# Altium schematic sheet PCB Bus.SchDoc
size A1
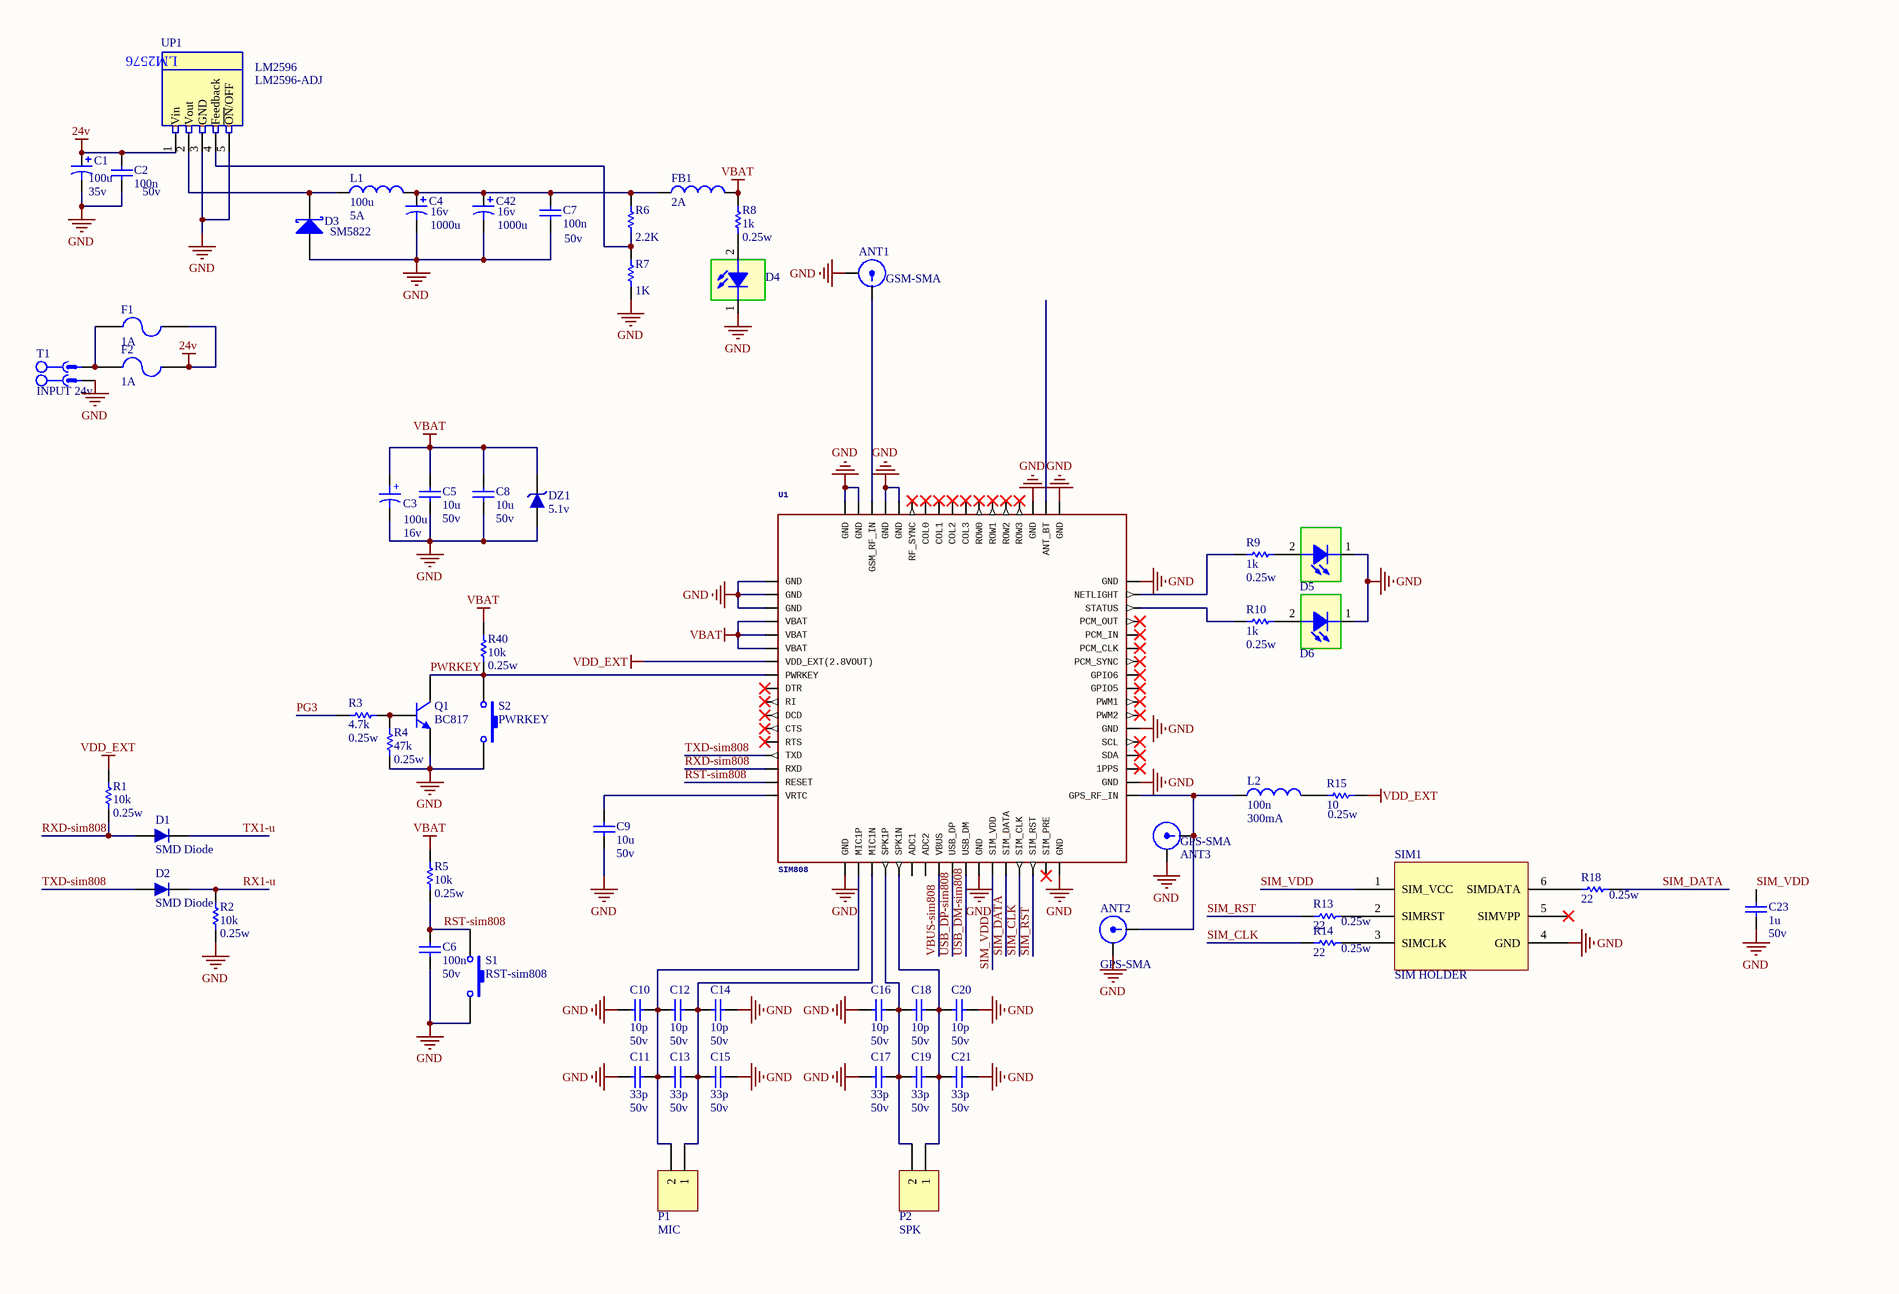
[diagram p0: PCB Bus.SchDoc, top left]
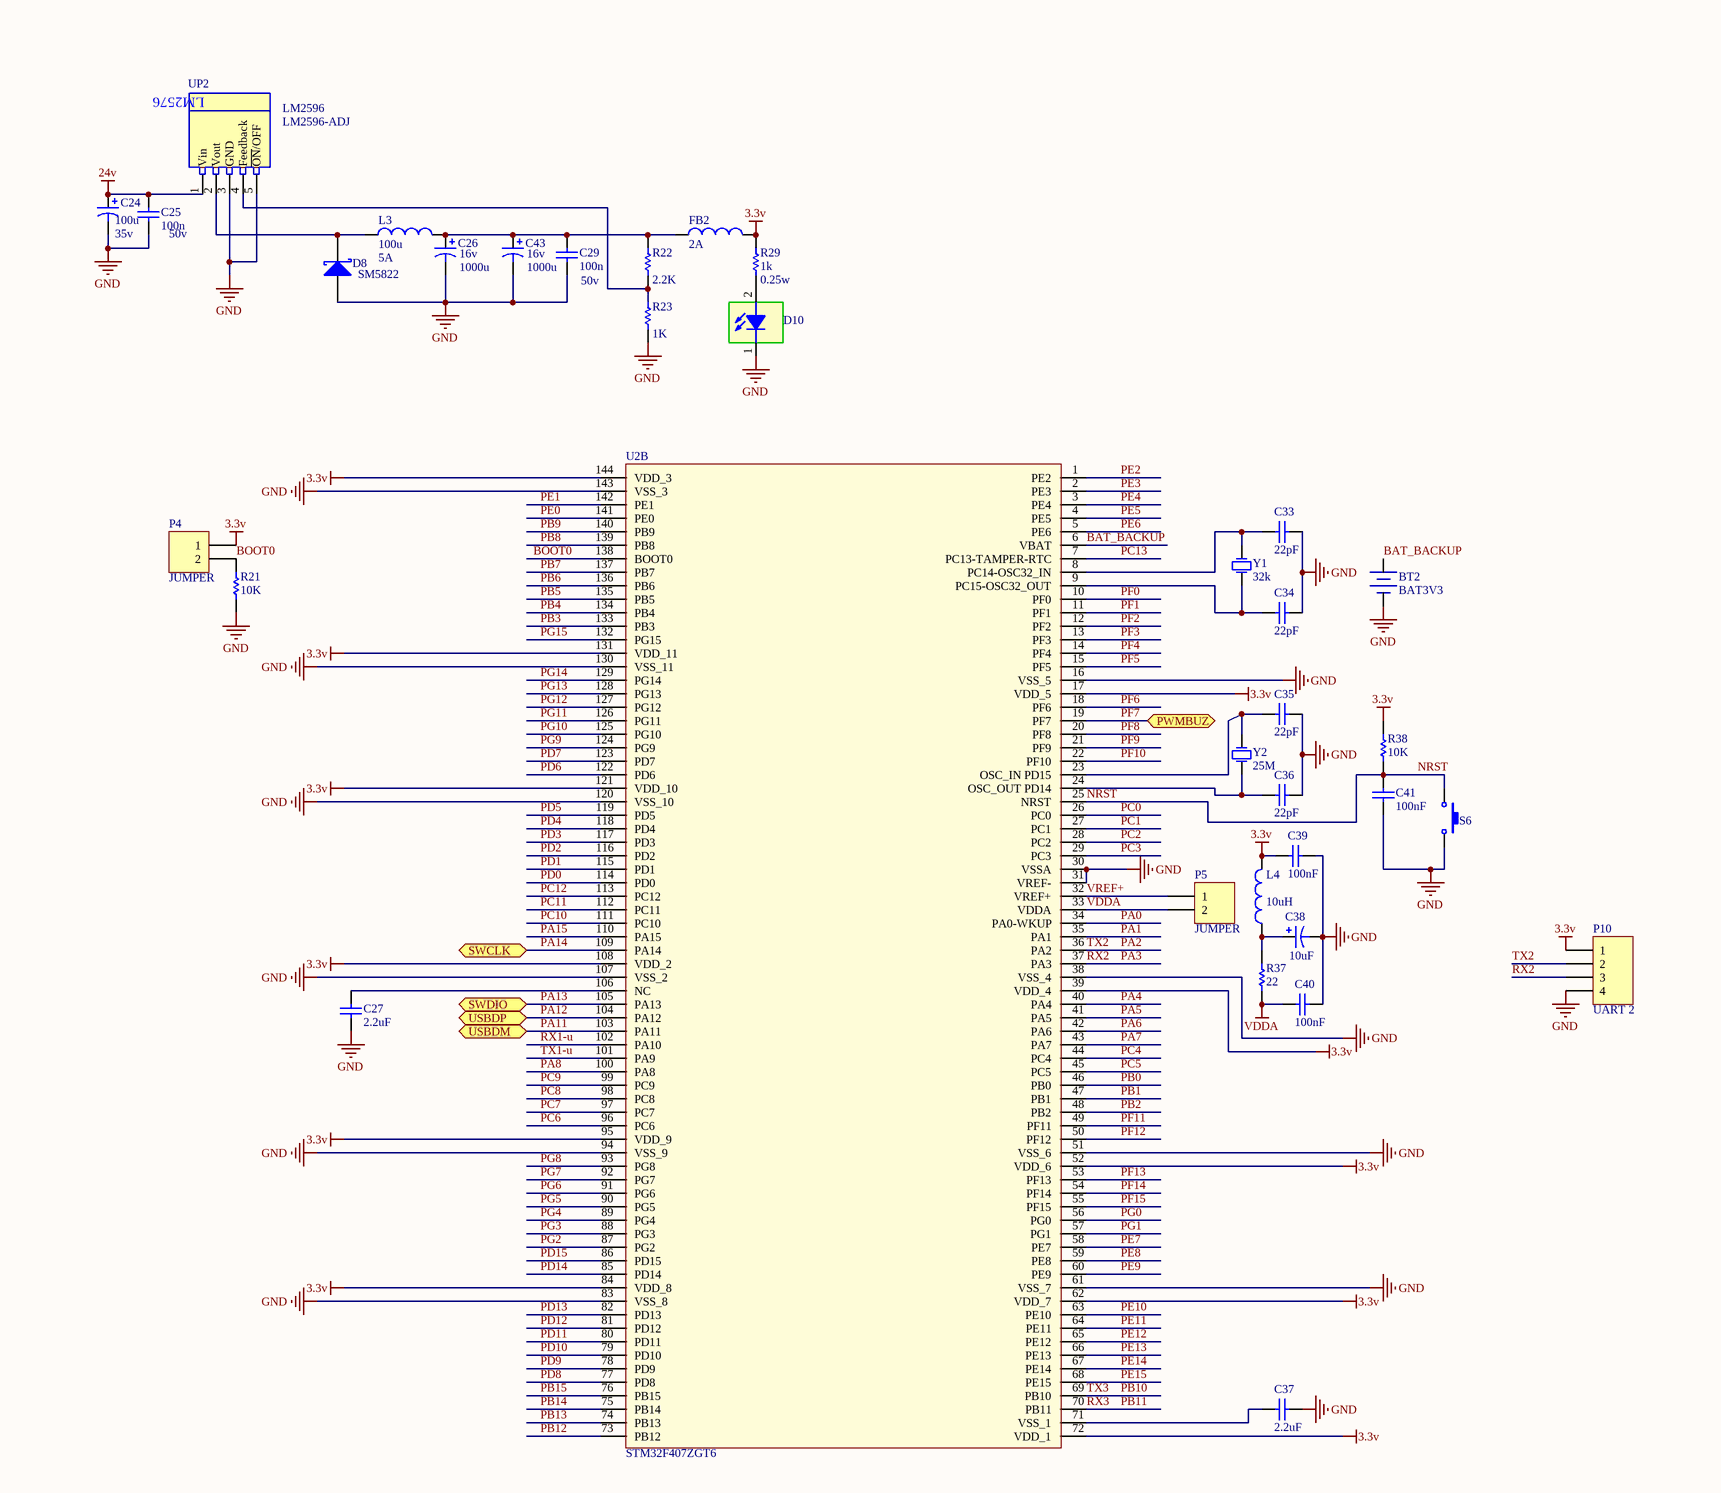
[diagram p1: PCB Bus.SchDoc, top right]
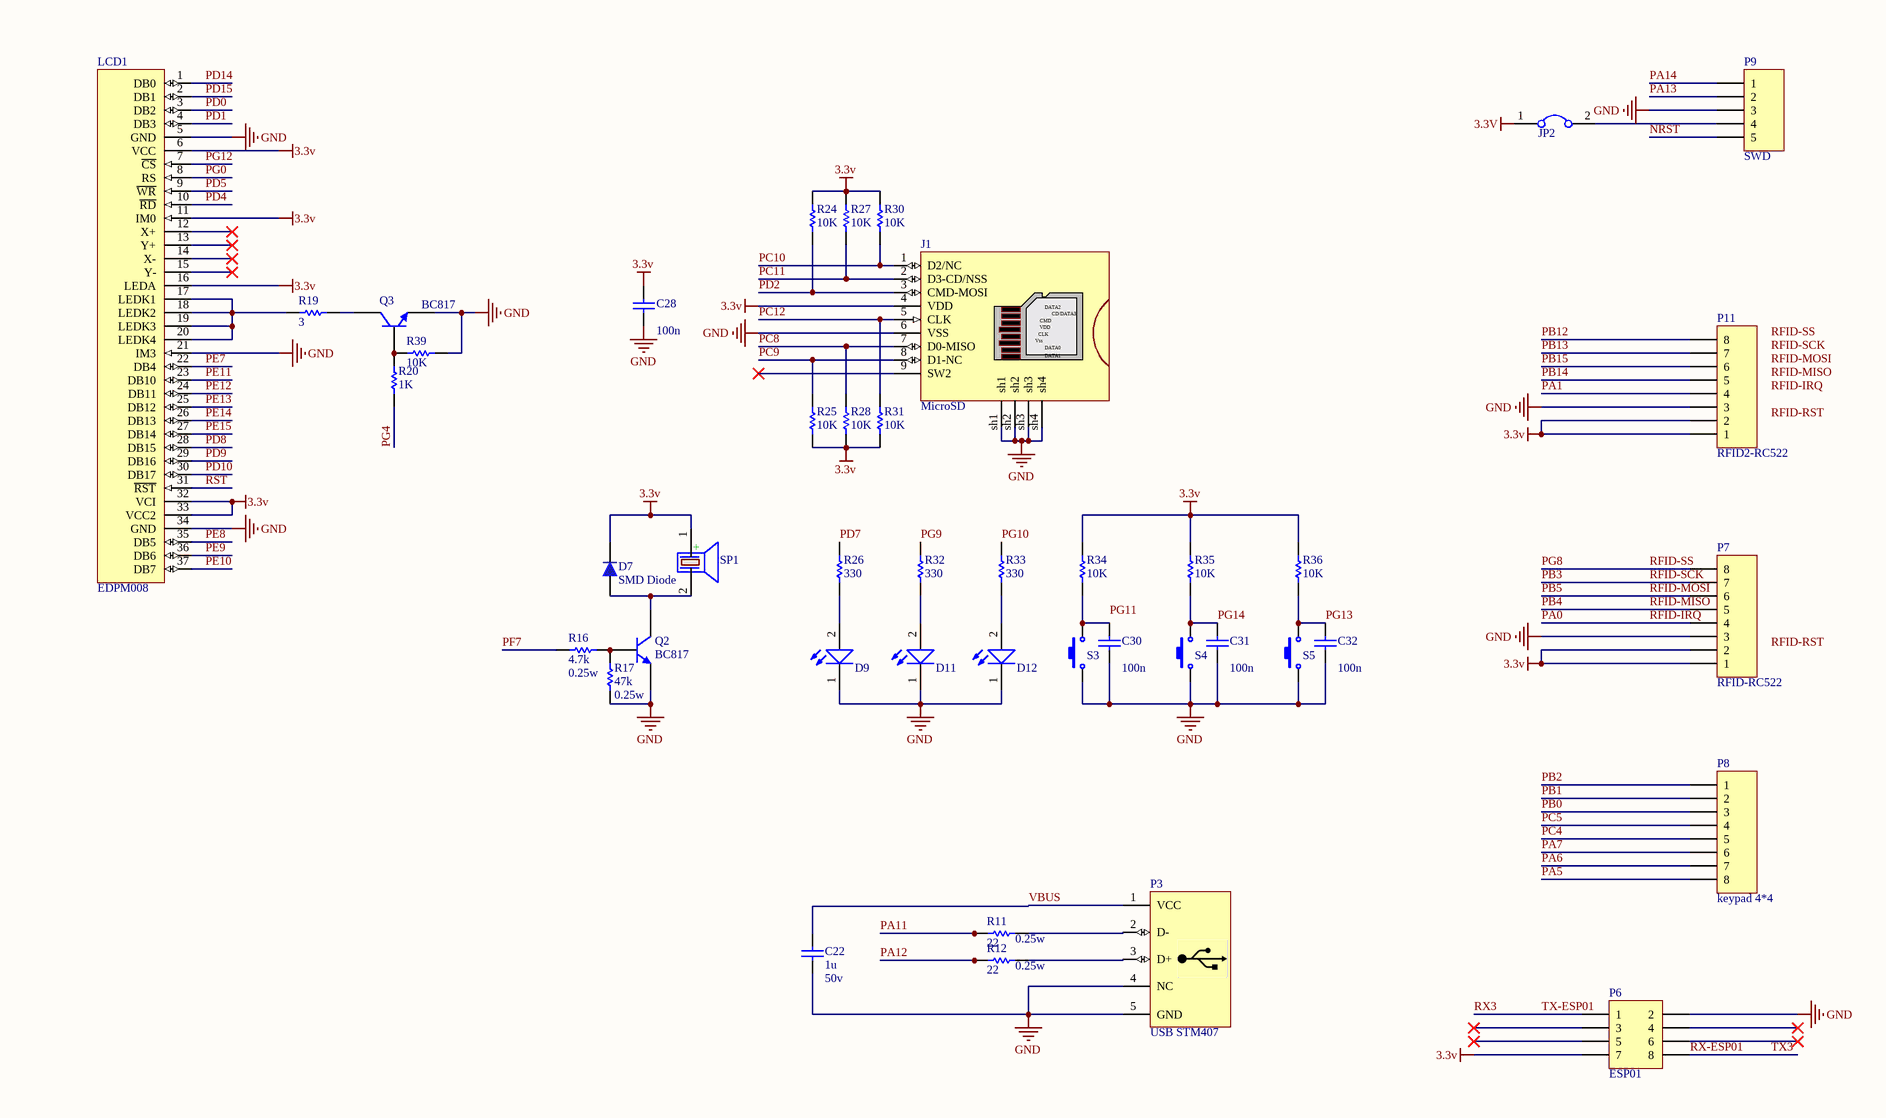
[diagram p2: PCB Bus.SchDoc, bottom right]

## Parts
ANT1  GSM-SMA  [SMA]
ANT2  GPS-SMA  [SMA]
ANT3  GPS-SMA  [SMA]
BT2  BAT3V3  [BTH1220]
C1  100u  value 35v  [Cap electrolitic radial 10x20-5]
C2  100n  value 50v  [1206 new 2]
C3  100u  Part. No: 16v  [Cap electrolitic radial 6x7-2.5]
C4  1000u  value 16v  [Cap electrolitic radial 10x20-5]
C5  10u  value 50v  [1206 new 2]
C6  100n  value 50v  [1206 new 2]
C7  100n  value 50v  [1206 new 2]
C8  10u  value 50v  [1206 new 2]
C9  10u  value 50v  [1206 new 2]
C10  10p  value 50v  [1206 new 2]
C11  33p  value 50v  [1206 new 2]
C12  10p  value 50v  [1206 new 2]
C13  33p  value 50v  [1206 new 2]
C14  10p  value 50v  [1206 new 2]
C15  33p  value 50v  [1206 new 2]
C16  10p  value 50v  [1206 new 2]
C17  33p  value 50v  [1206 new 2]
C18  10p  value 50v  [1206 new 2]
C19  33p  value 50v  [1206 new 2]
C20  10p  value 50v  [1206 new 2]
C21  33p  value 50v  [1206 new 2]
C22  1u  value 50v  [1206 new 2]
C23  1u  value 50v  [1206 new 2]
C24  100u  value 35v  [Cap electrolitic radial 10x20-5]
C25  100n  value 50v  [1206 new 2]
C26  1000u  value 16v  [Cap electrolitic radial 10x20-5]
C27  2.2uF  [1206 new 2]
C28  value 100n  [1206 new 2]
C29  100n  value 50v  [1206 new 2]
C30  value 100n  [1206 new 2]
C31  value 100n  [1206 new 2]
C32  value 100n  [1206 new 2]
C33  22pF  [1206 new 2]
C34  22pF  [1206 new 2]
C35  22pF  [1206 new 2]
C36  22pF  [1206 new 2]
C37  2.2uF  [1206 new 2]
C38  value 10uF  [Cap electrolitic radial 6x7-2.5]
C39  100nF  [1206 new 2]
C40  100nF  [1206 new 2]
C41  100nF  [1206 new 2]
C42  1000u  value 16v  [Cap electrolitic radial 10x20-5]
C43  1000u  value 16v  [Cap electrolitic radial 10x20-5]
D1  SMD Diode  [Diode 1206]
D2  SMD Diode  [Diode 1206]
D3  SM5822  [SMB]
D4  VBAT  [LED 1206]  (value not drawn)
D5  NET  [LED 1206]  (value not drawn)
D6  STATUS  [LED 1206]  (value not drawn)
D7  SMD Diode  [Diode 1206]
D8  SM5822  [SMB]
D9  LED SMD PACKAGE  [LED_SMD_1206]  (value not drawn)
D10  3.3v  [LED 1206]  (value not drawn)
D11  LED SMD PACKAGE  [LED_SMD_1206]  (value not drawn)
D12  LED SMD PACKAGE  [LED_SMD_1206]  (value not drawn)
DZ1  5.1v  [SOD80, LL-34]
F1  1A  [FUSE]
F2  1A  [FUSE DARB KESHOYI]
FB1  2A  [1206 new 2]
FB2  2A  [1206 new 2]
J1  MicroSD  [SD]
JP2  Jumper  [Jumper Small - 2.54 - GRAY]  (value not drawn)
L1  100u  value 5A  [inductor 5A 100u]
L2  100n  value 300mA  [1206 new 2]
L3  100u  value 5A  [inductor 5A 100u]
L4  value 10uH  [1206 new 2]
LCD1  EDPM008  [LCD 2.8]
P1  MIC  [HDR1X2]
P2  SPK  [HDR1X2]
P3  USB STM407  [USB2.5-2H4E]
P4  JUMPER  [HDR1X2]
P5  JUMPER  [HDR1X2]
P6  ESP01  [HDR2X4]
P7  RFID-RC522  [RFID RC522]
P8  keypad 4*4  [Keypad 2]
P9  SWD  [HDR1X5]
P10  UART 2  [HDR1X4]
P11  RFID2-RC522  [HDR1X8]
Q1  BC817  [SOT23_N]
Q2  BC817  [SOT23_N]
Q3  BC817  [SOT23_N]
R1  10k  value 0.25w  [1206 new 2]
R2  10k  value 0.25w  [1206 new 2]
R3  4.7k  value 0.25w  [1206 new 2]
R4  47k  value 0.25w  [1206 new 2]
R5  10k  value 0.25w  [1206 new 2]
R6  value 2.2K  [1206 new 2]
R7  value 1K  [1206 new 2]
R8  1k  value 0.25w  [1206 new 2]
R9  1k  value 0.25w  [1206 new 2]
R10  1k  value 0.25w  [1206 new 2]
R11  22  value 0.25w  [1206 new 2]
R12  22  value 0.25w  [1206 new 2]
R13  22  value 0.25w  [1206 new 2]
R14  22  value 0.25w  [1206 new 2]
R15  10  value 0.25w  [1206 new 2]
R16  4.7k  value 0.25w  [1206 new 2]
R17  47k  value 0.25w  [1206 new 2]
R18  22  value 0.25w  [1206 new 2]
R19  3  [1206 new 2]
R20  1K  [1206 new 2]
R21  10K  [1206 new 2]
R22  value 2.2K  [1206 new 2]
R23  value 1K  [1206 new 2]
R24  10K  [1206 new 2]
R25  10K  [1206 new 2]
R26  330  [1206 new 2]
R27  10K  [1206 new 2]
R28  10K  [1206 new 2]
R29  1k  value 0.25w  [1206 new 2]
R30  10K  [1206 new 2]
R31  10K  [1206 new 2]
R32  330  [1206 new 2]
R33  330  [1206 new 2]
R34  10K  [1206 new 2]
R35  10K  [1206 new 2]
R36  10K  [1206 new 2]
R37  22  [1206 new 2]
R38  10K  [1206 new 2]
R39  10K  [1206 new 2]
R40  10k  value 0.25w  [1206 new 2]
S1  RST-sim808  [PUSH BUTTOM 2PIN SMD]
S2  PWRKEY  [PUSH BUTTOM 2PIN SMD]
S3  Switch PB  [PB RIGHT]  (value not drawn)
S4  Switch PB  [PB RIGHT]  (value not drawn)
S5  Switch PB  [PB RIGHT]  (value not drawn)
S6  PB-RST-STM  [PUSH BUTTOM 2PIN SMD]  (value not drawn)
SIM1  SIM HOLDER  [SIM holder metal]
SP1  (no value)  [BUZZER 7.62mm DC]
T1  INPUT 24v  [MSTBV 2,5/2-G-5]
U1  SIM808  [SIM808]
U2  STM32F407ZGT6  [TQFP144_N]  (part B of 2)
UP1  LM2596  value LM2596-ADJ  [LM2576 SMD]
UP2  LM2596  value LM2596-ADJ  [LM2576 SMD]
Y1  32k  [XTAL RTC]
Y2  25M  [Crystal SMD]

## Ports
PWMBUZ, SWCLK, SWDIO, USBDM, USBDP

## Nets
3.3v: C28.2 C39.2 D7.2 FB2.2 J1.4(VDD) JP2.1 L4.2 LCD1.6(VCC) LCD1.11(IM0) LCD1.16(LEDA) LCD1.32(VCI) LCD1.33(VCC2) P4.1 P6.7 P7.1 P7.2 P10.1 P11.1 P11.2 R24.2 R25.1 R27.2 R28.1 R29.1 R30.2 R31.1 R34.2 R35.2 R36.2 R38.2 SP1.1(+) U2.17(VDD_5) U2.39(VDD_4) U2.52(VDD_6) U2.62(VDD_7) U2.72(VDD_1) U2.84(VDD_8) U2.95(VDD_9) U2.108(VDD_2) U2.121(VDD_10) U2.131(VDD_11) U2.144(VDD_3)
24v: C1.1 C2.1 C24.1 C25.1 F1.2 F2.2 UP1.1(Vin) UP2.1(Vin)
GND: ANT1.2 ANT2.2 ANT3.2 BT2.2(-) C1.2 C2.2 C3.2 C4.2 C5.1 C6.1 C7.2 C8.1 C9.1 C10.2 C11.2 C14.1 C15.1 C16.2 C17.2 C20.1 C21.1 C22.2 C23.2 C24.2 C25.2 C26.2 C27.2 C28.1 C29.2 C30.1 C31.1 C32.1 C33.2 C34.2 C35.2 C36.2 C37.2 C38.2 C39.1 C40.1 C41.1 C42.2 C43.2 D3.1(A) D4.1 D5.1 D6.1 D8.1(A) D9.1(K) D10.1 D11.1(K) D12.1(K) DZ1.1 J1.6(VSS) J1.sh1 J1.sh2 J1.sh3 J1.sh4 LCD1.5(GND) LCD1.21(IM3) LCD1.34(GND) P3.4(NC) P3.5(GND) P6.2 P7.3 P9.3 P10.4 P11.3 Q1.2(E) Q2.2(E) Q3.2(E) R2.1 R4.1 R7.1 R17.1 R21.1 R23.1 R39.2 S1.2 S2.2 S3.1 S4.1 S5.1 S6.2 SIM1.4(GND) T1.1 U1.P$1(GND) U1.P$2(GND) U1.P$3(GND) U1.P$18(GND) U1.P$28(GND) U1.P$34(GND) U1.P$36(GND) U1.P$40(GND) U1.P$51(GND) U1.P$52(GND) U1.P$54(GND) U1.P$64(GND) U1.P$65(GND) U1.P$67(GND) U1.P$68(GND) U2.16(VSS_5) U2.30(VSSA) U2.31(VREF-) U2.38(VSS_4) U2.51(VSS_6) U2.61(VSS_7) U2.83(VSS_8) U2.94(VSS_9) U2.107(VSS_2) U2.120(VSS_10) U2.130(VSS_11) U2.143(VSS_3) UP1.3(GND) UP1.5(~{ON}/OFF) UP2.3(GND) UP2.5(~{ON}/OFF)
SW1: J1.10(SW1)
VBAT: C3.1 C5.2 C8.2 DZ1.2 FB1.2 R5.2 R8.1 R40.2 U1.P$4(VBAT) U1.P$5(VBAT) U1.P$6(VBAT)
VDD_EXT: R1.2 R15.1 U1.P$7(VDD_EXT(2.8VOUT))
VDDA: C40.2 P5.2 R37.1 U2.33(VDDA)
BAT_BACKUP: BT2.1(+) U2.6(VBAT)
BOOT0: P4.2 R21.2 U2.138(BOOT0)
NRST: C41.2 P9.5 R38.1 S6.1 U2.25(NRST)
PA0: P7.4 U2.34(PA0-WKUP)  [also labelled RFID-IRQ]
PA1: P11.4 U2.35(PA1)
PA2: P10.2 U2.36(PA2)  [also labelled TX2]
PA3: P10.3 U2.37(PA3)  [also labelled RX2]
PA4: U2.40(PA4)
PA5: P8.8 U2.41(PA5)
PA6: P8.7 U2.42(PA6)
PA7: P8.6 U2.43(PA7)
PA8: U2.100(PA8)
PA11: R11.2 U2.103(PA11) ; port USBDM
PA12: R12.2 U2.104(PA12) ; port USBDP
PA13: P9.2 U2.105(PA13) ; port SWDIO
PA14: P9.1 U2.109(PA14) ; port SWCLK
PA15: U2.110(PA15)
PB0: P8.3 U2.46(PB0)
PB1: P8.2 U2.47(PB1)
PB2: P8.1 U2.48(PB2)
PB3: P7.7 U2.133(PB3)  [also labelled RFID-SCK]
PB4: P7.5 U2.134(PB4)  [also labelled RFID-MISO]
PB5: P7.6 U2.135(PB5)  [also labelled RFID-MOSI]
PB6: U2.136(PB6)
PB7: U2.137(PB7)
PB8: U2.139(PB8)
PB9: U2.140(PB9)
PB10: P6.8 U2.69(PB10)  [also labelled RX-ESP01, TX3]
PB11: P6.1 U2.70(PB11)  [also labelled RX3, TX-ESP01]
PB12: P11.8 U2.73(PB12)
PB13: P11.7 U2.74(PB13)
PB14: P11.5 U2.75(PB14)
PB15: P11.6 U2.76(PB15)
PC0: U2.26(PC0)
PC1: U2.27(PC1)
PC2: U2.28(PC2)
PC3: U2.29(PC3)
PC4: P8.5 U2.44(PC4)
PC5: P8.4 U2.45(PC5)
PC6: U2.96(PC6)
PC7: U2.97(PC7)
PC8: J1.7(D0-MISO) R28.2 U2.98(PC8)
PC9: J1.8(D1-NC) R25.2 U2.99(PC9)
PC10: J1.1(D2/NC) R30.1 U2.111(PC10)
PC11: J1.2(D3-CD/NSS) R27.1 U2.112(PC11)
PC12: J1.5(CLK) R31.2 U2.113(PC12)
PC13: U2.7(PC13-TAMPER-RTC)
PD0: LCD1.3(DB2) U2.114(PD0)
PD1: LCD1.4(DB3) U2.115(PD1)
PD2: J1.3(CMD-MOSI) R24.1 U2.116(PD2)
PD3: U2.117(PD3)
PD4: LCD1.10(~{RD}) U2.118(PD4)
PD5: LCD1.9(~{WR}) U2.119(PD5)
PD6: U2.122(PD6)
PD7: R26.2 U2.123(PD7)
PD8: LCD1.28(DB15) U2.77(PD8)
PD9: LCD1.29(DB16) U2.78(PD9)
PD10: LCD1.30(DB17) U2.79(PD10)
PD11: U2.80(PD11)
PD12: U2.81(PD12)
PD13: U2.82(PD13)
PD14: LCD1.1(DB0) U2.85(PD14)
PD15: LCD1.2(DB1) U2.86(PD15)
PE0: U2.141(PE0)
PE1: U2.142(PE1)
PE2: U2.1(PE2)
PE3: U2.2(PE3)
PE4: U2.3(PE4)
PE5: U2.4(PE5)
PE6: U2.5(PE6)
PE7: LCD1.22(DB4) U2.58(PE7)
PE8: LCD1.35(DB5) U2.59(PE8)
PE9: LCD1.36(DB6) U2.60(PE9)
PE10: LCD1.37(DB7) U2.63(PE10)
PE11: LCD1.23(DB10) U2.64(PE11)
PE12: LCD1.24(DB11) U2.65(PE12)
PE13: LCD1.25(DB12) U2.66(PE13)
PE14: LCD1.26(DB13) U2.67(PE14)
PE15: LCD1.27(DB14) U2.68(PE15)
PF0: U2.10(PF0)
PF1: U2.11(PF1)
PF2: U2.12(PF2)
PF3: U2.13(PF3)
PF4: U2.14(PF4)
PF5: U2.15(PF5)
PF6: U2.18(PF6)
PF7: R16.1 U2.19(PF7) ; port PWMBUZ
PF8: U2.20(PF8)
PF9: U2.21(PF9)
PF10: U2.22(PF10)
PF11: U2.49(PF11)
PF12: U2.50(PF12)
PF13: U2.53(PF13)
PF14: U2.54(PF14)
PF15: U2.55(PF15)
PG0: LCD1.8(RS) U2.56(PG0)
PG1: U2.57(PG1)
PG2: U2.87(PG2)
PG3: R3.1 U2.88(PG3)
PG4: R20.2 U2.89(PG4)
PG5: U2.90(PG5)
PG6: U2.91(PG6)
PG7: U2.92(PG7)
PG8: P7.8 U2.93(PG8)  [also labelled RFID-SS]
PG9: R32.2 U2.124(PG9)
PG10: R33.2 U2.125(PG10)
PG11: U2.126(PG11)
PG12: LCD1.7(~{CS}) U2.127(PG12)
PG13: C32.2 R36.1 S5.2 U2.128(PG13)
PG14: C31.2 R35.1 S4.2 U2.129(PG14)
PG15: U2.132(PG15)
PWRKEY: Q1.3(C) R40.1 S2.1 U1.P$8(PWRKEY)
RST: LCD1.31(~{RST})
RST-sim808: C6.2 R5.1 S1.1 U1.P$16(RESET)
RX1-u: D2.2 R2.2 U2.102(PA10)
RXD-sim808: D1.1 R1.1 U1.P$15(RXD)
SIM_CLK: R14.2 U1.P$31(SIM_CLK)
SIM_DATA: R18.1 U1.P$30(SIM_DATA)
SIM_RST: R13.2 U1.P$32(SIM_RST)
SIM_VDD: C23.1 SIM1.1(SIM_VCC) U1.P$29(SIM_VDD)
TX1-u: D1.2 U2.101(PA9)
TXD-sim808: D2.1 U1.P$14(TXD)
USB_DM-sim808: U1.P$27(USB_DM)
USB_DP-sim808: U1.P$26(USB_DP)
VBUS: P3.1(VCC)
VBUS-sim808: U1.P$25(VBUS)
VREF+: P5.1 U2.32(VREF+)
NetANT1_1: ANT1.1 U1.P$66(GSM_RF_IN)
NetANT2_1: ANT2.1 ANT3.1 L2.1 U1.P$35(GPS_RF_IN)
NetC4_1: C4.1 C7.1 C42.1 FB1.1 L1.2 R6.2
NetC9_2: C9.2 U1.P$17(VRTC)
NetC10_1: C10.1 C11.1 C12.2 C13.2 P1.2 U1.P$19(MIC1P)
NetC12_1: C12.1 C13.1 C14.2 C15.2 P1.1 U1.P$20(MIC1N)
NetC16_1: C16.1 C17.1 C18.2 C19.2 P2.2 U1.P$21(SPK1P)
NetC18_1: C18.1 C19.1 C20.2 C21.2 P2.1 U1.P$22(SPK1N)
NetC26_1: C26.1 C29.1 C43.1 FB2.1 L3.2 R22.2
NetC27_1: C27.1 U2.106(NC)
NetC30_2: C30.2 R34.1 S3.2
NetC33_1: C33.1 U2.8(PC14-OSC32_IN) Y1.2(OSC2)
NetC34_1: C34.1 U2.9(PC15-OSC32_OUT) Y1.1(OSC1)
NetC35_1: C35.1 U2.23(OSC_IN_PD15) Y2.2(OSC2)
NetC36_1: C36.1 U2.24(OSC_OUT_PD14) Y2.1(OSC1)
NetC37_1: C37.1 U2.71(VSS_1)
NetC38_1: C38.1 L4.1 R37.2
NetD3_2: D3.2(K) L1.1 UP1.2(Vout)
NetD4_2: D4.2 R8.2
NetD5_2: D5.2 R9.2
NetD6_2: D6.2 R10.2
NetD7_1: D7.1 Q2.3(C) SP1.2(-)
NetD8_2: D8.2(K) L3.1 UP2.2(Vout)
NetD9_2: D9.2(A) R26.1
NetD10_2: D10.2 R29.2
NetD11_2: D11.2(A) R32.1
NetD12_2: D12.2(A) R33.1
NetF1_1: F1.1 F2.1 T1.2
NetJP2_2: JP2.2 P9.4
NetL2_2: L2.2 R15.2
NetLCD1_17: LCD1.17(LEDK1) LCD1.18(LEDK2) LCD1.19(LEDK3) LCD1.20(LEDK4) R19.1
NetP3_2: P3.2(D-) R11.1
NetP3_3: P3.3(D+) R12.1
NetQ1_1: Q1.1(B) R3.2 R4.2
NetQ2_1: Q2.1(B) R16.2 R17.2
NetQ3_1: Q3.1(B) R20.1 R39.1
NetQ3_3: Q3.3(C) R19.2
NetR6_1: R6.1 R7.2 UP1.4(Feedback)
NetR9_1: R9.1 U1.P$50(NETLIGHT)
NetR10_1: R10.1 U1.P$49(STATUS)
NetR13_1: R13.1 SIM1.2(SIMRST)
NetR14_1: R14.1 SIM1.3(SIMCLK)
NetR18_2: R18.2 SIM1.6(SIMDATA)
NetR22_1: R22.1 R23.2 UP2.4(Feedback)

Not connected (* = marked no-connect by the designer): C22 1; J1 9(SW2)*; LCD1 12(X+)* 13(Y+)* 14(X-)* 15(Y-)*; P6 3* 4* 5* 6*; SIM1 5(SIMVPP)*; U1 P$9(DTR)* P$10(RI)* P$11(DCD)* P$12(CTS)* P$13(RTS)* P$23(ADC1) P$24(ADC2) P$33(SIM_PRE)* P$37(1PPS)* P$38(SDA)* P$39(SCL)* P$41(PWM2)* P$42(PWM1)* P$43(GPIO5)* P$44(GPIO6)* P$45(PCM_SYNC)* P$46(PCM_CLK)* P$47(PCM_IN)* P$48(PCM_OUT)* P$53(ANT_BT) P$55(ROW3)* P$56(ROW2)* P$57(ROW1)* P$58(ROW0)* P$59(COL3)* P$60(COL2)* P$61(COL1)* P$62(COL0)* P$63(RF_SYNC)*

## Notes on the sheet
- Labels drawn without touching a wire or pin: PG11, RFID-IRQ, RFID-MISO, RFID-MOSI, RFID-RST, RFID-SCK, RFID-SS
- (in symbol Cap electrolitic radial 10x21) +
- (in symbol LM2576-Adj) LM2576
- (in symbol MicroSD) DATA2; CD/DATA3; CMD; Vss; DATA0; DATA1

## Library data of the parts
ANT1-ANT3 = ANT SMA: Antenna; Designer: Ali Hafizi
BT2 = Battry Backup: Designer: Abbas Basereh; Data: 16-12-2016; Link: *; Part. No: *
C1 C4 C24 C26 C38 C42 C43 = Cap Pol1: Polarized Capacitor (Radial); Published: 8-Jun-2000; LatestRevisionDate: 17-Jul-2002; LatestRevisionNote: Re-released for DXP Platform.; PackageReference: RB7.6-15; Publisher: Altium Limited; PackageDescription: Polarized Capacitor (Radial); 2 Leads
C2 C5-C23 C25 C28-C32 = Cap: Capacitor; Published: 8-Jun-2000; LatestRevisionDate: 17-Jul-2002; LatestRevisionNote: Re-released for DXP Platform.; PackageReference: RAD-0.3; Publisher: Altium Limited
  C2 C5-C23 C25 C29: PackageDescription: Radial Cap, Thru-Hole; 2 Leads; 0.3 in Pin Spacing
C3 = Cap electrolitic radial 10x21: Cap electrolitic radial; Designer: Abbas Basereh; Data: 16-12-2016
C27 C33-C37 C39-C41 = Cap: Capacitor; Value: 100pF; Published: 8-Jun-2000; Revision: July-2002: Re-released for DXP Platform.; Publisher: Altium Limited
D1 D2 D7 = Diode SMD Package: Diode SMD Pakage
D3 D8 = D Schottky: Schottky Diode; Published: 8-Jun-2000; LatestRevisionDate: 17-Jul-2002; LatestRevisionNote: Re-released for DXP Platform.; PackageReference: SMB; Publisher: Altium Limited; PackageDescription: DO-214-AA/SMB; 2 C-Bend Leads; Body 5.3 x 3.6 mm, inc. leads (LxW); Code_JEDEC: DO-214-AA
D4-D6 D10 = LED SMD 1206: SMD 1206 LED; pin to pad: 1>2 2>1
D9 D11 D12 = LED SMD PACKAGE: SMD Mono-color Chip LED Waterclear; Part Number: 150080BS75000; Peak Wavelength: 465 nm; Forward Voltage: 3.2 V; Published Date: Jan 2017; Publisher: Ali Hafizi
DZ1 = ZENER GENERAL DIODE: DIODE ZENER GENERAL; VALUE: 500mw; Published: 2017-1-12; PackageVersion: 2017-1-12; PackageReference: DO 35; Publisher: Abbas Basereh; PackageDescription: DIODE GEN ZENER; ComponentLink1Description: Manufacturer Link; ComponentLink2Description: Datasheet
F1 F2 = Fuse 2: Fuse; Published: 8-Jun-2000; LatestRevisionDate: 17-Jul-2002; LatestRevisionNote: Re-released for DXP Platform.; PackageReference: PIN-W2/E2.8; Publisher: Altium Limited; PackageDescription: Thru-Hole; 2 Leads
FB1 FB2 L1-L4 = Inductor: Code_IEC: 1005; Published: 8-Jun-2000; LatestRevisionDate: 29-May-2009; LatestRevisionNote: IPC-7351 Footprint Added.; PackageReference: 0402-A; Publisher: Altium Limited; PackageDescription: Chip Inductor; Code_JEITA: 0402
J1 = MicroSD: MicroSD_altium designer (M.Hariri); Created by:: *; VALUE: *
JP2 = Jumper: Company: E.P.I.L; Defualt State: Close; Design Date: 2011/11/02
LCD1 = EDPM008: ELT240320TP -- 2.8" Touch Screen TFT LCD 240x320 Dots
P1 P2 P4 P5 = Header 2: Header, 2-Pin; LatestRevisionDate: 17-Jul-2002; LatestRevisionNote: Re-released for DXP Platform.; Publisher: Altium Limited
P3 = USB MINI: USB Connector MINI-AB Type
P6 = Header 4X2: Header, 4-Pin, Dual row; LatestRevisionDate: 17-Jul-2002; LatestRevisionNote: Re-released for DXP Platform.; Publisher: Altium Limited
P7 P8 P11 = Header 8: Header, 8-Pin; LatestRevisionDate: 17-Jul-2002; LatestRevisionNote: Re-released for DXP Platform.; Publisher: Altium Limited
P9 = Header 5: Header, 5-Pin; LatestRevisionDate: 17-Jul-2002; LatestRevisionNote: Re-released for DXP Platform.; Publisher: Altium Limited
P10 = Header 4: Header, 4-Pin; LatestRevisionDate: 17-Jul-2002; LatestRevisionNote: Re-released for DXP Platform.; Publisher: Altium Limited
Q1-Q3 = BC817: 45 V, 500 mA NPN general-purpose transistors; Published: 2017-2-8; LatestRevisionDate: 2017; LatestRevisionNote: IPC-7351 Footprint Added.; DatasheetVersion: 2017; PackageVersion: 2017-2-8; PackageReference: SOT23; Publisher: Abbas Basereh; PackageDescription: 3-Pin SOT-23 Package 0.95 mm Pitch, 2.3 mm Lead Span; ComponentLink1Description: Manufacturer Link; ComponentLink1URL: http://www.nxp.com/; ComponentLink2Description: Datasheet; ComponentLink2URL: http://www.nxp.com/
R1-R18 R22 R23 R29 R40 = Res Semi: Semiconductor Resistor; Published: 8-Jun-2000; LatestRevisionDate: 17-Jul-2002; LatestRevisionNote: Re-released for DXP Platform.; PackageReference: AXIAL-0.5; Publisher: Altium Limited; PackageDescription: Axial Device, Thru-Hole; 2 Leads; 0.5 in Pin Spacing
R19 R21 R24-R28 R30-R39 = Res1: Resistor; Value: 1K; Published: 8-Jun-2000; Revision: July-2002: Re-released for DXP Platform.; Publisher: Altium Limited
R20 = Res1: Resistor; Published: 8-Jun-2000; Revision: July-2002: Re-released for DXP Platform.; Publisher: Altium Limited; Value: 1K
S1 S2 = SW-PB: Switch; Published: 24-Mar-1999; LatestRevisionDate: 17-Jul-2002; LatestRevisionNote: Re-released for DXP Platform.; PackageReference: SPST-2; Publisher: Altium Limited; PackageDescription: Switch; 2 Leads
S3-S6 = Switch PB: Push Button Switch
SIM1 = SIM HOLDER: Deigner: Ali Hafizi
SP1 = PIEZO BUZZER: PIEZO BUZZER ACTIVE; Designer: Abbas Basereh; Comment_1: SPEAKER AND BEEP; Design Date: 1395/11/14; ComponentLink2Description: Reference; PackageDescription: THD; Publisher: Abbas Basereh; Mounting Technology: THD; Pin Count: 2; Status: Unreleased
T1 = CON_Phoenix_MSTBV_02: 2 Pitch: 5 mm Color: green Contact surface: Tin Assembly; Manufacturer: PHOENIX CONTACT; Connector type: PCB Terminal Block; designer: ABBAS BASEREH; Max Current: 12 A; Positions: 2; Voltage: 320 V; Category: Connector; ComponentLink1Description: Header, Nominal current: 12 A Rated voltage (III/2): 320 V Number of positions: 2 Pitch: 5 mm Color: green Contact surface: Tin Assembly: Soldering  DESIGNER:ABBAS BASEREH; ComponentLink2Description: Reference; Mounting Technology: Through-Hole; Pin Count: 2; Revision 1: 2017-3-1; Status: Unreleased; PART.NO: PHOENIX
U1 = GSM_SIM808_LITERAL: SIM808 GSM Module
UP1 UP2 = LM2576-Adj: 1.2-50V, 3A variable output step-down switching voltage regulator; Designer: Abbas Basereh; Data: 16-12-2016; Link: *; Part.No: *
Y1 Y2 = XTAL: XTAL Crystal; Designer: ABBAS BASEREH; Value: 12 MHz; Design Date: 2017-1-3; ComponentLink1Description: Datasheet; ComponentLink2Description: Reference; Mounting Technology: Surface Mount\Through-Hole; Status: Unreleased